# Altium schematic sheet STM32_SPI.SchDoc
size A4; SheetNumber: 6; SheetTotal: 8
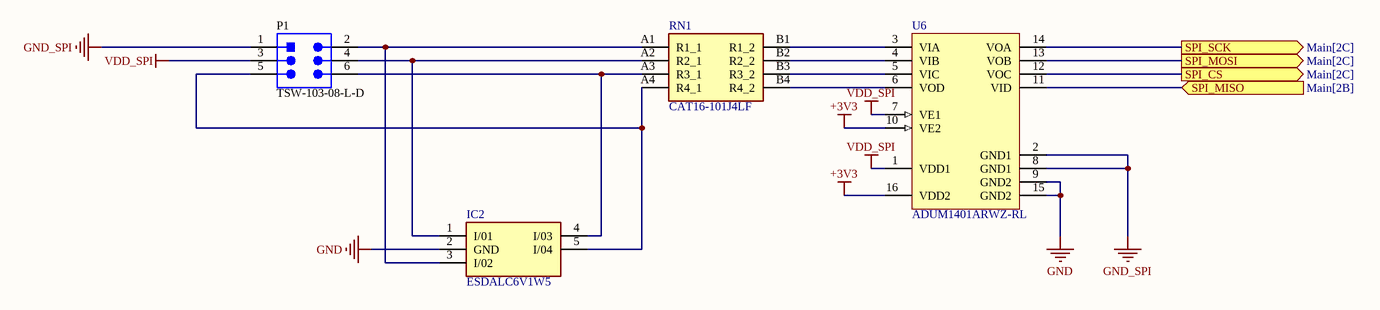
[diagram p0: STM32_SPI.SchDoc]

## Parts
IC2  ESDALC6V1W5  [SOT65P210X110-5N]
P1  TSW-103-08-L-D  [SMTC-TSW-103-08-L-D_V]
RN1  CAT16-101J4LF  [CAT16101J4LF]
U6  ADUM1401ARWZ-RL  [ADI-RW-16_N]

## Ports
SPI_CS (out, see Main[2C]), SPI_MISO (in, see Main[2B]), SPI_MOSI (out, see Main[2C]), SPI_SCK (out, see Main[2C])

## Nets
+3V3: U6.10(VE2) U6.16(VDD2)
GND: IC2.2(GND) U6.9(GND2) U6.15(GND2)
GND_SPI: P1.1 U6.2(GND1) U6.8(GND1)
VDD_SPI: P1.3 U6.1(VDD1) U6.7(VE1)
SPI_CS: U6.12(VOC) ; port SPI_CS
SPI_MISO: U6.11(VID) ; port SPI_MISO
SPI_MOSI: U6.13(VOB) ; port SPI_MOSI
SPI_SCK: U6.14(VOA) ; port SPI_SCK
NetIC2_1: IC2.1(I/01) P1.4 RN1.A2(R2_1)
NetIC2_3: IC2.3(I/02) P1.2 RN1.A1(R1_1)
NetIC2_4: IC2.4(I/03) P1.6 RN1.A3(R3_1)
NetIC2_5: IC2.5(I/04) P1.5 RN1.A4(R4_1)
NetRN1_B1: RN1.B1(R1_2) U6.3(VIA)
NetRN1_B2: RN1.B2(R2_2) U6.4(VIB)
NetRN1_B3: RN1.B3(R3_2) U6.5(VIC)
NetRN1_B4: RN1.B4(R4_2) U6.6(VOD)

## Library data of the parts
IC2 = ESDALC6V1W5: Integrated Circuit; Manufacturer_Name: STMicroelectronics; Datasheet Link: http://www.st.com/web/en/resource/technical/document/datasheet/CD00002946.pdf; Height: 1.1mm; Manufacturer_Part_Number: ESDALC6V1W5; Mouser Part Number: 511-ESDALC6V1W5; Mouser Price/Stock: https://www.mouser.co.uk/ProductDetail/STMicroelectronics/ESDALC6V1W5?qs=C%2FEejvvdwQ4xcyFnfrFaDw%3D%3D; Arrow Part Number: ESDALC6V1W5; Arrow Price/Stock: https://www.arrow.com/en/products/esdalc6v1w5/stmicroelectronics?utm_currency=USD&region=nac
P1 = CMP-1024-00336-5: Male Header, Pitch 2.54 mm, 2 x 3 Position, Height 8.38 mm, Tail Length 5.08 mm, -55 to 125 degC, RoHS, Bulk; Manufacturer: Samtec; DatasheetVersion: 04/2012; ComponentLink3URL: http://suddendocs.samtec.com/prints/tsw-xxx-xx-x-x-xx-xxx-footprint.pdf; PackageReference: TSW-103-08-L-D; Mounting Technology: Through Hole; Min Operating Temperature: -55 degC; ComponentLink2Description: Datasheet; Lead Pitch: 2.54 mm; ComponentLink1Description: Manufacturer URL; Mount: Through Hole; ComponentLink1URL: http://www.samtec.com/; ComponentLink3Description: Package Specification; Max Operating Temperature: 125 degC; PackageDescription: Male Header, Pitch 2.54 mm, 2 x 3 Position, Height 8.38 mm, Tail Length 5.08 mm; ComponentLink2URL: https://datasheet.ciiva.com/25618/0900766b81154476-25618436.pdf; RoHSCompliant: true
RN1 = CAT16-101J4LF: Resistor Network; Manufacturer_Name: Bourns; Datasheet Link: https://datasheet.datasheetarchive.com/originals/distributors/SFDatasheet-7/sf-000140092.pdf; Height: 0.5mm; Manufacturer_Part_Number: CAT16-101J4LF; Mouser Part Number: 652-CAT16-101J4LF; Mouser Price/Stock: https://www.mouser.co.uk/ProductDetail/Bourns/CAT16-101J4LF?qs=Fn3VdHBzkcn2is%252B1oonJSQ%3D%3D; Arrow Part Number: CAT16-101J4LF; Arrow Price/Stock: https://www.arrow.com/en/products/cat16-101j4lf/bourns?region=nac
U6 = CMP-0534-00564-1: Quad Channel Digital Isolator, 2.5 KV rms Insulation Rating, 1 Mbps Data Rate, 100 ns Delay, Industrial, 16-pin SOIC (RW-16), Reel; Manufacturer: Analog Devices; Max Data Rate: 1Mbps; ComponentLink4URL: Product URL:http://www.analog.com/en/interface-isolation/digital-isolators/adum1401/products/product.html; ComponentLink1Description: Manufacturer URL; ComponentLink4Description: URL Link1; Code_JEDEC: MS-013-AA; Max Operating Temp (degreesC): 125; ComponentLink2Description: Datasheet; ComponentLink3URL: http://www.analog.com/static/imported-files/packages/PKG_PDF/SOIC_WIDE%20%28RW%29/RW_16.pdf; PackageVersion: 032707-B, 03/2007; PartNumber: ADUM1401ARWZ-RL; ComponentLink2URL: http://www.analog.com/static/imported-files/data_sheets/ADuM1400_1401_1402.pdf; ComponentLink5Description: URL Link2; ComponentLink1URL: http://www.analog.com/en/index.html; PackageReference: RW-16; ComponentLink5URL: Reference Circuit:http://www.analog.com/en/interface-isolation/digital-isolators/adum1401/products/product.html#product-recommendations; DatasheetVersion: Rev. H; ComponentLink3Description: Package Specification; Mounting Technology: Surface Mount; PackageDescription: 16-Pin Standard Small Outline Package, Body 10.3 x 7.5 mm, Pitch 1.27 mm